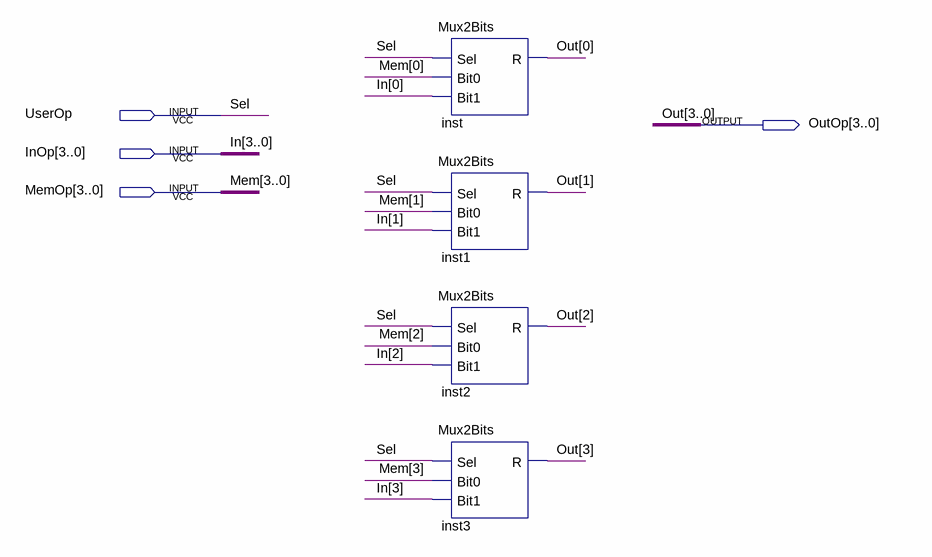
[diagram p0: schematic sheet]
// Quartus schematic OpUserMemMux.bdf as structural Verilog: 4 symbols, 4 pins
module OpUserMemMux (
  input  UserOp,
  input  [3:0] InOp,
  input  [3:0] MemOp,
  output [3:0] OutOp
);

  Mux2Bits inst (.Sel(UserOp), .Bit0(MemOp[0]), .Bit1(InOp[0]), .R(OutOp[0]));
  Mux2Bits inst1 (.Sel(UserOp), .Bit0(MemOp[1]), .Bit1(InOp[1]), .R(OutOp[1]));
  Mux2Bits inst2 (.Sel(UserOp), .Bit0(MemOp[2]), .Bit1(InOp[2]), .R(OutOp[2]));
  Mux2Bits inst3 (.Sel(UserOp), .Bit0(MemOp[3]), .Bit1(InOp[3]), .R(OutOp[3]));

  // Other names for the same wires on the sheet: In[3:0] = InOp; Mem[3:0] = MemOp; Out[3:0] = OutOp; Sel = UserOp
endmodule
